# EAGLE design phase and amplifier ssb (EAGLE 9.1.2)
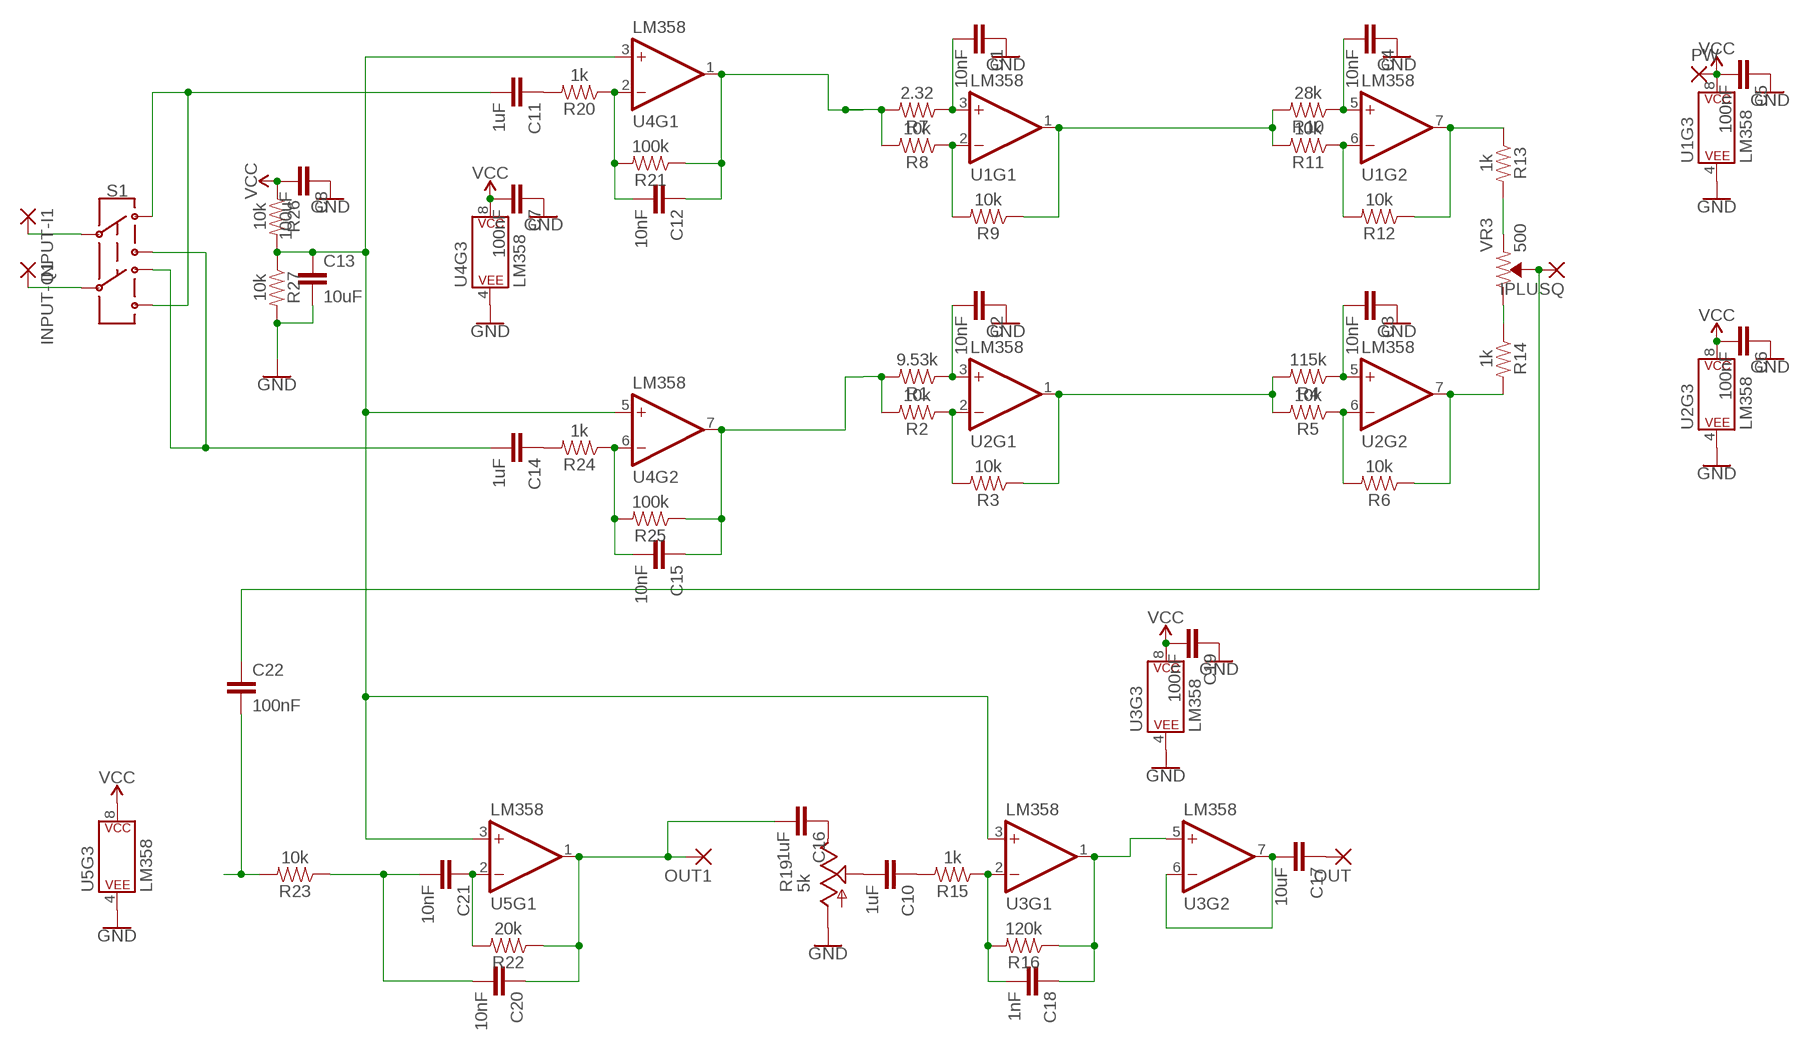
[diagram p0: schematic, sheet 1]

## Parts
C1  10nF  C5/3.5  [C5B3.5]
C2  10nF  C5/3.5  [C5B3.5]
C3  10nF  C5/3.5  [C5B3.5]
C4  10nF  C5/3.5  [C5B3.5]
C5  100nF  C5/3.5  [C5B3.5]
C6  100nF  C5/3.5  [C5B3.5]
C7  100nF  C5/3.5  [C5B3.5]
C8  100uF  C5/3.5  [C5B3.5]
C10  1uF  C5/3.5  [C5B3.5]
C11  1uF  C5/3.5  [C5B3.5]
C12  10nF  C5/3.5  [C5B3.5]
C13  10uF  C5/3.5  [C5B3.5]
C14  1uF  C5/3.5  [C5B3.5]
C15  10nF  C5/3.5  [C5B3.5]
C16  1uF  C5/3.5  [C5B3.5]
C17  10uF  C5/3.5  [C5B3.5]
C18  1nF  C5/3.5  [C5B3.5]
C19  100nF  C5/3.5  [C5B3.5]
C20  10nF  C5/3.5  [C5B3.5]
C21  10nF  C5/3.5  [C5B3.5]
C22  100nF  C5/3.5  [C5B3.5]
INPUT-I1  2,54/1,1  [2,54/1,1]
INPUT-Q1  2,54/1,1  [2,54/1,1]
IPLUSQ  2,54/1,1  [2,54/1,1]
OUT  2,54/1,1  [2,54/1,1]
OUT1  2,54/1,1  [2,54/1,1]
PW  2,54/1,1  [2,54/1,1]
R1  9.53k  1KOHM-HORIZ-1/4W-1%  [AXIAL-0.3]
R2  10k  1KOHM-HORIZ-1/4W-1%  [AXIAL-0.3]
R3  10k  1KOHM-HORIZ-1/4W-1%  [AXIAL-0.3]
R4  115k  1KOHM-HORIZ-1/4W-1%  [AXIAL-0.3]
R5  10k  1KOHM-HORIZ-1/4W-1%  [AXIAL-0.3]
R6  10k  1KOHM-HORIZ-1/4W-1%  [AXIAL-0.3]
R7  2.32  1KOHM-HORIZ-1/4W-1%  [AXIAL-0.3]
R8  10k  1KOHM-HORIZ-1/4W-1%  [AXIAL-0.3]
R9  10k  1KOHM-HORIZ-1/4W-1%  [AXIAL-0.3]
R10  28k  1KOHM-HORIZ-1/4W-1%  [AXIAL-0.3]
R11  10k  1KOHM-HORIZ-1/4W-1%  [AXIAL-0.3]
R12  10k  1KOHM-HORIZ-1/4W-1%  [AXIAL-0.3]
R13  1k  1KOHM-HORIZ-1/4W-1%  [AXIAL-0.3]
R14  1k  1KOHM-HORIZ-1/4W-1%  [AXIAL-0.3]
R15  1k  1KOHM-HORIZ-1/4W-1%  [AXIAL-0.3]
R16  120k  1KOHM-HORIZ-1/4W-1%  [AXIAL-0.3]
R19  5k  TRIM_US-B25V  [B25V]
R20  1k  1KOHM-HORIZ-1/4W-1%  [AXIAL-0.3]
R21  100k  1KOHM-HORIZ-1/4W-1%  [AXIAL-0.3]
R22  20k  1KOHM-HORIZ-1/4W-1%  [AXIAL-0.3]
R23  10k  1KOHM-HORIZ-1/4W-1%  [AXIAL-0.3]
R24  1k  1KOHM-HORIZ-1/4W-1%  [AXIAL-0.3]
R25  100k  1KOHM-HORIZ-1/4W-1%  [AXIAL-0.3]
R26  10k  1KOHM-HORIZ-1/4W-1%  [AXIAL-0.3]
R27  10k  1KOHM-HORIZ-1/4W-1%  [AXIAL-0.3]
S1  SWITCH-DPDT-PTH-GPI-152-3013  [SWITCH_DPDT_PTH_GPI-152-3013]
U1  LM358  [DIP08]
U2  LM358  [DIP08]
U3  LM358  [DIP08]
U4  LM358  [DIP08]
U5  LM358  [DIP08]
VR3  500  TRIMPOT-PTH-10MM-KNOB-1/2W-10%  [TRIMPOT-PTH-3386U]

## Nets
GND: C1.1 C2.1 C3.1 C4.1 C5.1 C6.1 C7.1 C8.1 C13.2 C19.1 R19.A R27.P$2 U1.4(P$V-) U2.4(P$V-) U3.4(P$V-) U4.4(P$V-) U5.4(P$V-)
N$1: C2.2 R1.P$1 U2.3(+IN)
N$2: R2.P$1 R3.P$2 U2.2(-IN)
N$3: R3.P$1 R4.P$2 R5.P$2 U2.1(OUT)
N$4: C13.1 R26.P$2 R27.P$1 U3.3(+IN) U4.3(+IN) U4.5(+IN) U5.3(+IN)
N$5: C3.2 R4.P$1 U2.5(+IN)
N$6: R5.P$1 R6.P$2 U2.6(-IN)
N$7: R8.P$1 R9.P$2 U1.2(-IN)
N$8: R6.P$1 R14.P$2 U2.7(OUT)
N$9: C1.2 R7.P$1 U1.3(+IN)
N$10: C12.1 R7.P$2 R8.P$2 R21.P$1 U4.1(OUT)
N$11: C4.2 R10.P$1 U1.5(+IN)
N$12: R9.P$1 R10.P$2 R11.P$2 U1.1(OUT)
N$13: R11.P$1 R12.P$2 U1.6(-IN)
N$14: R13.P$2 VR3.1(CCW)
N$15: R12.P$1 R13.P$1 U1.7(OUT)
N$16: R14.P$1 VR3.3(CW)
N$17: C22.1 IPLUSQ.1(P) VR3.2(WIPER)
N$18: C15.1 R1.P$2 R2.P$2 R25.P$1 U4.7(OUT)
N$19: C11.2 S1.10 S1.21
N$20: C18.1 R16.P$1 U3.1(OUT) U3.5(+IN)
N$21: C18.2 R15.P$1 R16.P$2 U3.2(-IN)
N$22: INPUT-I1.1(P) S1.C@1
N$23: C10.1 R15.P$2
N$24: C10.2 R19.S
N$25: C16.1 R19.E
N$26: C17.2 U3.6(-IN) U3.7(OUT)
N$27: C12.2 R20.P$1 R21.P$2 U4.2(-IN)
N$28: C14.2 S1.11 S1.20
N$29: C11.1 R20.P$2
N$30: C17.1 OUT.1(P)
N$31: C15.2 R24.P$1 R25.P$2 U4.6(-IN)
N$32: C22.2 R23.P$2
N$33: C14.1 R24.P$2
N$34: C16.2 C20.1 OUT1.1(P) R22.P$1 U5.1(OUT)
N$35: C21.1 R22.P$2 U5.2(-IN)
N$36: C20.2 C21.2 R23.P$1
N$37: INPUT-Q1.1(P) S1.C@2
VCC: C5.2 C6.2 C7.2 C8.2 C19.2 PW.1(P) R26.P$1 U1.8(P$V+) U2.8(P$V+) U3.8(P$V+) U4.8(P$V+) U5.8(P$V+)
Unconnected: U5.5(+IN) U5.6(-IN) U5.7(OUT)

## Library data of the parts
C1-C8 C10-C22 = capacitor-wima:C: CAPACITOR naming: grid - package width
INPUT-I1 INPUT-Q1 IPLUSQ OUT OUT1 PW = wirepad:2,54/1,1: THROUGH-HOLE PAD
R1-R12 R16 R21-R23 R25-R27 = SparkFun-Resistors:1KOHM: 1kΩ resistor A resistor is a passive two-terminal electrical component that implements electrical resistance as a circuit element. Resistors act to reduce current flow, and, at the same time, act to lower voltage levels within circuits. - Wikipedia; PROD_ID: RES-12182; VALUE: 1k
R13-R15 R20 R24 = SparkFun-Resistors:1KOHM: 1kΩ resistor A resistor is a passive two-terminal electrical component that implements electrical resistance as a circuit element. Resistors act to reduce current flow, and, at the same time, act to lower voltage levels within circuits. - Wikipedia; PROD_ID: RES-12182
R19 = pot:TRIM_US-: POTENTIOMETER
S1 = SparkFun-Switches:SWITCH-DPDT: Double-Pole, Double-Throw (DPDT) Switch Double-pole, double-throw switches. Variant Overview PTH-GPI-152-3013 Used on SparkFun Geiger Counter <https://www.sparkfun.com/products/11345> SMD-AY0202 Surface Mount DPDT Switch <https://www.sparkfun.com/products/597> (COM-00597) Used on e.g. LilyPad Arduino USB - ATmega32U4 Board <https://www.sparkfun.com/products/12049>; PROD_ID: SWCH-10554
U1-U5 = SparkFun-IC-Amplifiers:LM358: LM358 Jellybean op-amp Datasheet <http://www.sparkfun.com/datasheets/Components/General/LM358.pdf> SparkFun Products Op-Amp (Thru-Hole) - LM358 <https://www.sparkfun.com/products/9456> (COM-09456); PROD_ID: IC-09172
VR3 = SparkFun-Resistors:TRIMPOT: Trimming Potentiometer (Trimpot) Three-terminal potentiometers, with an adjustable wiper and two adjustable resistors. A pot can be used to create a configurable voltage divider, or as a variable resistor. "Trimpots" are a subset of potentiometers, usually intended for "set-and-forget" applications. They're often more delicate than standard potentiometers - rated for fewer turns. Variants PTH-KNOB - PTH Trimpot w/ finger-adjustable knob Trimpot 10K with Knob <https://www.sparkfun.com/products/9806> (COM-09806) Datasheet <http://www.sparkfun.com/datasheets/Components/General/TSR-3386.pdf> SMD-3MM-CLOSED-FRAME - SMD 3mm Square Closed-Frame Trimpot Used on e.g. EasyDriver - Stepper Motor Driver <https://www.sparkfun.com/products/12779> Datasheet <http://www.bitechnologies.com/pdfs/22.pdf> (22AR10KTR) SMD-5MM - SMD 5mm Square Closed-Frame Trimpot Used on e.g. IOIO-OTG - V2.2 <https://www.sparkfun.com/products/13613> Datasheet <http://www.vishay.com/docs/51008/ts53.pdf> (TS53YL502MR10) SMD-3MM-1/10W-25% - 3mm Square Open-Frame Trimpot Used on e.g. SparkFun Shapeoko <https://www.sparkfun.com/products/13899> Datasheet <http://www.bourns.com/docs/Product-Datasheets/TC33.pdf> (TC33X-2-103E); PROD_ID: RES-09730; SF_SKU: COM-09806; VALUE: 10k

## Net classes
0 default: width 0.762 mm, drill 0.762 mm, clearance 0.508 mm

## Board
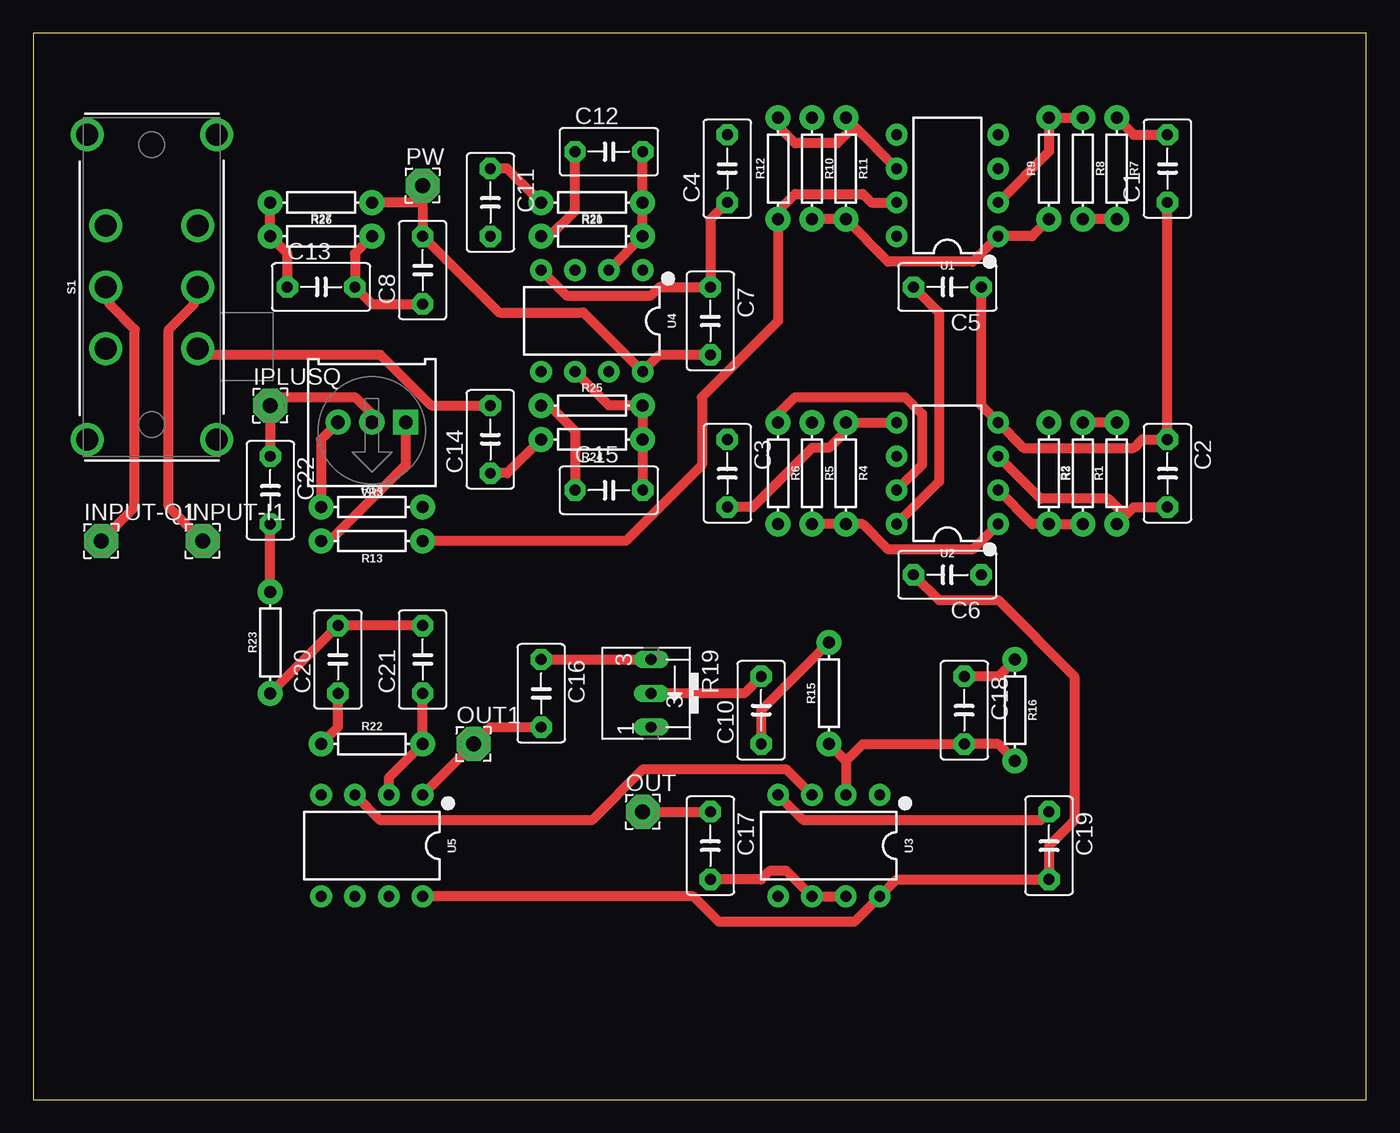
[diagram p1: board, top side]
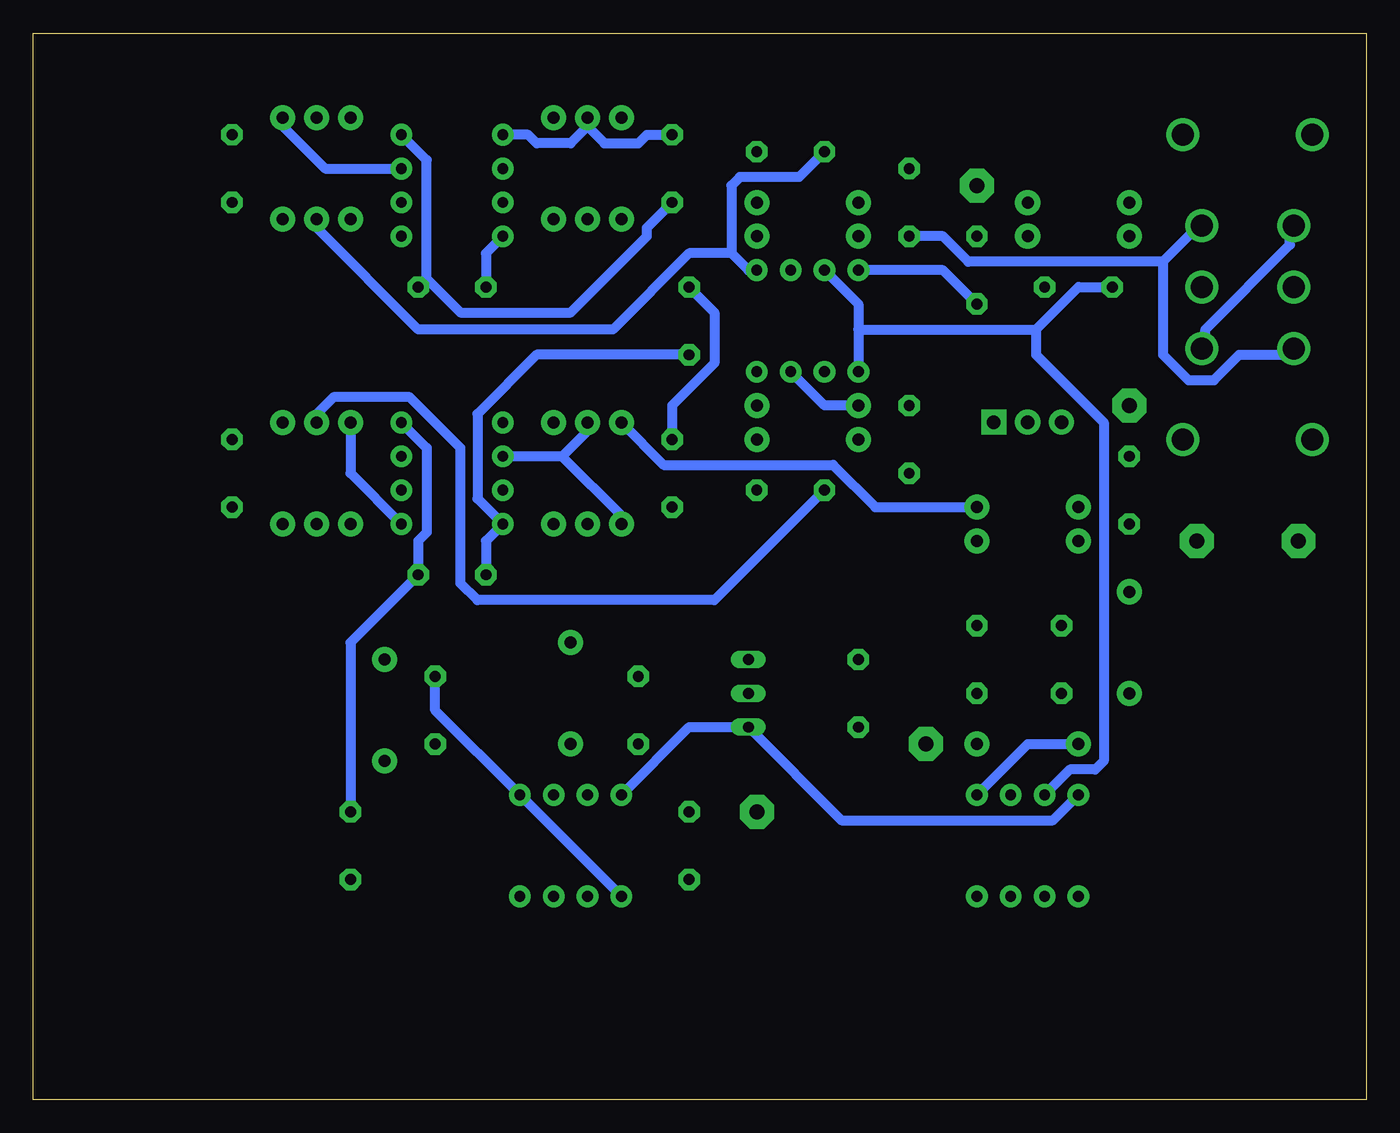
[diagram p2: board, bottom side, seen from below]

Size 100 x 80 mm. Coordinates in mm from the lower left corner, seen from the top.
Outline: 0,0 100,0 100,80 0,80 0,0
Copper layers (1*16): Top 0.035mm / dielectric 1.5mm / Bottom 0.035mm
Design rules "default": minimum track width 6mil, minimum drill 0.35mm, track to track 6mil, track to pad 6mil, pad to pad 6mil, via to via 6mil, smd to smd 6mil, copper to edge 40mil, drill to drill 6mil, minimum pad ring 10mil, minimum via ring 8mil, stop-mask expansion 4mil, vias tented up to drill 0mil, thermal gap 10mil

### Footprints (pad centres in the part's own frame; a part is rotated, then mirrored left to right if it is on the bottom)
C5B3.5 = drill 0.813 pad 1.6 octagon: 1 -2.54,0; 2 2.54,0
2,54/1,1 = drill 1.118 pad 2.54 octagon: 1 0,0
AXIAL-0.3 = drill 0.9 pad 1.88: P$1 -3.81,0; P$2 3.81,0
B25V = drill 0.813 long: A 2.54,0.635; E -2.54,0.635; S 0,0.635
SWITCH_DPDT_PTH_GPI-152-3013 = drill 1.65: 10 -4.6,3.455; 11 -4.6,-3.455; 20 4.6,3.455; 21 4.6,-3.455; C@1 0,3.455; C@2 0,-3.455; P$7 11.43,4.85; P$8 -11.43,4.85; P$9 -11.43,-4.85; P$10 11.43,-4.85
DIP08 = drill 0.813 pad 1.626: 1 -3.81,-3.81; 2 -1.27,-3.81; 3 1.27,-3.81; 4 3.81,-3.81; 5 3.81,3.81; 6 1.27,3.81; 7 -1.27,3.81; 8 -3.81,3.81
TRIMPOT-PTH-3386U = drill 1.016 pad 1.88 square: 1 -2.54,-0.015 | drill 1.016 pad 1.88: 2 0,-0.015; 3 2.54,-0.015

### Placement (x,y rotation side)
C1  85.09,69.85 90 top
C2  85.09,46.99 270 top
C3  52.07,46.99 270 top
C4  52.07,69.85 90 top
C5  68.58,60.96 180 top
C6  68.58,39.37 180 top
C7  50.8,58.42 270 top
C8  29.21,62.23 90 top
C10  54.61,29.21 90 top
C11  34.29,67.31 270 top
C12  43.18,71.12 0 top
C13  21.59,60.96 0 top
C14  34.29,49.53 90 top
C15  43.18,45.72 0 top
C16  38.1,30.48 270 top
C17  50.8,19.05 270 top
C18  69.85,29.21 270 top
C19  76.2,19.05 270 top
C20  22.86,33.02 90 top
C21  29.21,33.02 90 top
C22  17.78,45.72 270 top
INPUT-I1  12.7,41.91 0 top
INPUT-Q1  5.08,41.91 0 top
IPLUSQ  17.78,52.07 0 top
OUT  45.72,21.59 0 top
OUT1  33.02,26.67 0 top
PW  29.21,68.58 0 top
R1  81.28,46.99 90 top
R2  78.74,46.99 90 top
R3  76.2,46.99 270 top
R4  60.96,46.99 270 top
R5  58.42,46.99 270 top
R6  55.88,46.99 270 top
R7  81.28,69.85 270 top
R8  78.74,69.85 270 top
R9  76.2,69.85 90 top
R10  58.42,69.85 270 top
R11  60.96,69.85 270 top
R12  55.88,69.85 90 top
R13  25.4,41.91 180 top
R14  25.4,44.45 0 top
R15  59.69,30.48 90 top
R16  73.66,29.21 270 top
R19  45.72,30.48 270 top
R20  41.91,67.31 180 top
R21  41.91,64.77 0 top
R22  25.4,26.67 0 top
R23  17.78,34.29 90 top
R24  41.91,49.53 180 top
R25  41.91,52.07 0 top
R26  21.59,67.31 180 top
R27  21.59,64.77 0 top
S1  8.89,60.96 270 top
U1  68.58,68.58 90 top
U2  68.58,46.99 90 top
U3  59.69,19.05 180 top
U4  41.91,58.42 180 top
U5  25.4,19.05 180 top
VR3  25.4,50.8 180 top

### Tracks (layer width: path | path; a pad name or v marks a point on that pad's centre or on a via)
GND
  Top 0.762: C4.1 50.8,66.04 C7.1 46.99,60.96 46.35,60.33 40.01,60.33 U4.4 | R27.P$2 24.13,63.5 C13.2 25.4,59.69 C8.1 | C5.1 71.12,52.07 U2.4 74.3,48.9 82.55,48.9 83.19,49.53 C2.1 C1.1 | U3.4 57.78,20.95 75.56,20.95 C19.1
  Bottom 0.762: C3.1 52.07,52.07 48.9,55.24 48.9,59.05 C7.1 | U4.4 31.75,62.23 C8.1 | U3.4 50.8,27.94 R19.A 39.37,20.95 23.5,20.95 U5.4 | U2.4 70.48,48.9 70.48,42.55 71.12,41.91 C6.1 76.2,34.29 C19.1 | U1.4 70.48,70.48 70.48,61.59 | C5.1 70.48,61.59 | C4.1 53.98,65.41 53.98,64.77 59.69,59.05 67.94,59.05 70.48,61.59
N$1
  Top 0.762: C2.2 82.55,44.45 81.92,43.81 | U2.3 75.56,45.09 80.64,45.09 81.92,43.81 | 81.92,43.81 R1.P$1
N$2
  Top 0.762: U2.2 74.93,43.18 R3.P$2 R2.P$1
N$3
  Top 0.762: R5.P$2 R4.P$2 62.23,43.18 64.14,41.27 70.48,41.27 U2.1
  Bottom 0.762: U2.1 76.2,46.99 R3.P$1
N$4
  Top 0.762: U5.3 26.04,20.95 41.91,20.95 45.72,24.77 56.52,24.77 U3.3 | C13.1 19.05,63.5 R27.P$1 R26.P$2
  Bottom 0.762: 38.1,57.78 38.1,59.69 U4.3 | 38.1,57.78 U4.5 | C13.1 21.59,60.96 24.77,57.78 | 38.1,57.78 24.77,57.78 | U5.3 22.23,24.77 20.32,24.77 19.68,25.4 19.68,50.8 24.77,55.88 24.77,57.78
N$5
  Top 0.762: C3.2 53.98,44.45 58.42,48.9 59.69,48.9 60.96,50.16 R4.P$1 U2.5
N$6
  Bottom 0.762: 60.33,48.26 U2.6 | 60.33,48.26 58.42,50.16 R5.P$1 | R6.P$2 55.88,43.81 60.33,48.26
N$7
  Top 0.762: U1.2 76.2,71.12 R9.P$2 R8.P$1
N$8
  Top 0.762: U2.7 66.67,47.62 66.67,51.44 65.41,52.7 57.15,52.7 55.88,51.44 R6.P$1
  Bottom 0.762: R14.P$2 36.83,44.45 40.01,47.62 52.7,47.62 R6.P$1
N$9
  Top 0.762: C1.2 82.55,72.39 R7.P$1
  Bottom 0.762: U1.3 78.11,69.85 81.28,73.03 R7.P$1
N$10
  Top 0.762: R7.P$2 R8.P$2 | C12.1 40.64,66.67 38.73,64.77 R21.P$1
  Bottom 0.762: U4.1 46.35,62.23 47.62,63.5 | 47.62,63.5 47.62,68.58 46.99,69.22 42.55,69.22 C12.1 | R8.P$2 78.74,65.41 71.12,57.78 56.52,57.78 50.8,63.5 47.62,63.5
N$11
  Bottom 0.762: C4.2 53.98,72.39 54.61,71.75 57.15,71.75 58.42,73.03 | U1.5 62.87,72.39 62.23,71.75 59.69,71.75 58.42,73.03 | 58.42,73.03 R10.P$1
N$12
  Top 0.762: R10.P$2 R11.P$2 64.14,62.87 70.48,62.87 U1.1 74.93,64.77 R9.P$1
N$13
  Top 0.762: 61.59,73.03 U1.6 | R12.P$2 55.88,73.03 57.15,71.75 60.33,71.75 61.59,73.03 | 61.59,73.03 R11.P$1
N$14
  Top 0.762: R13.P$2 22.23,41.91 27.94,47.62 VR3.1
N$15
  Top 0.762: U1.7 62.87,67.31 62.23,67.94 57.15,67.94 55.88,66.67 R12.P$1 55.88,58.42 50.16,52.7 50.16,47.62 44.45,41.91 R13.P$1
N$16
  Top 0.762: R14.P$1 21.59,49.53 VR3.3
N$17
  Top 0.762: C22.1 IPLUSQ.1 18.41,52.7 24.13,52.7 25.4,51.44 VR3.2
N$18
  Top 0.762: R1.P$2 R2.P$2 | C15.1 40.64,50.16 38.73,52.07 R25.P$1
  Bottom 0.762: U4.7 40.64,52.07 R25.P$1 | R2.P$2 78.74,51.44 77.47,52.7 71.75,52.7 67.94,48.9 67.94,38.73 66.67,37.47 48.9,37.47 C15.1
N$19
  Bottom 0.762: C11.2 31.75,64.77 29.84,62.87 15.24,62.87 | 15.24,62.87 12.7,65.41 S1.10 | 15.24,62.87 15.24,55.88 13.34,53.98 11.43,53.98 9.53,55.88 5.71,55.88 S1.21
N$20
  Top 0.762: C18.1 72.39,31.75 R16.P$1
  Bottom 0.762: U3.5 U3.1 69.85,29.21 C18.1
N$21
  Top 0.762: R16.P$2 72.39,26.67 C18.2 62.23,26.67 60.96,25.4 | 60.96,25.4 U3.2 | R15.P$1 60.96,25.4
N$22
  Top 0.762: INPUT-I1.1 10.16,44.45 10.16,57.78 12.06,59.69 12.06,60.96 S1.C@1
N$23
  Top 0.762: C10.1 54.61,29.21 R15.P$2
N$24
  Top 0.762: R19.S 53.34,30.48 C10.2
N$25
  Top 0.762: C16.1 R19.E
N$26
  Top 0.762: C17.2 54.61,16.51 55.24,17.14 56.52,17.14 U3.6 U3.7
N$27
  Top 0.762: C12.2 R20.P$1 R21.P$2 U4.2
N$28
  Top 0.762: C14.2 29.84,52.07 26.04,55.88 12.7,55.88 S1.20
  Bottom 0.762: S1.11 5.71,65.41 5.71,64.14 12.06,57.78 12.06,56.52 S1.20
N$29
  Top 0.762: C11.1 35.56,69.85 R20.P$2
N$30
  Top 0.762: OUT.1 C17.1
N$31
  Top 0.762: C15.2 R24.P$1 R25.P$2 43.18,52.07 U4.6
N$32
  Top 0.762: R23.P$2 C22.2
N$33
  Top 0.762: C14.1 35.56,46.99 R24.P$2
N$34
  Top 0.762: C20.1 22.86,27.94 R22.P$1 | C16.2 34.29,27.94 OUT1.1 U5.1
  Bottom 0.762: R22.P$1 25.4,26.67 U5.1
N$35
  Top 0.762: C21.1 R22.P$2 26.67,24.13 U5.2
N$36
  Top 0.762: C21.2 C20.2 R23.P$1
N$37
  Top 0.762: INPUT-Q1.1 7.62,44.45 7.62,57.78 5.71,59.69 5.71,60.96 S1.C@2
VCC
  Top 0.762: U5.8 49.53,15.24 51.44,13.34 61.59,13.34 U3.8 64.77,16.51 C19.2 76.2,19.05 78.11,20.95 78.11,31.75 72.39,37.47 67.94,37.47 C6.2 | U2.8 67.94,46.35 67.94,59.05 C5.2 | C7.2 46.99,55.88 U4.8 41.27,59.05 34.92,59.05 C8.2 29.21,67.31 | PW.1 29.21,67.31 | 29.21,67.31 R26.P$1
  Bottom 0.762: C6.2 66.04,41.91 U2.8 66.67,45.09 66.67,51.44 62.23,55.88 C7.2 | C5.2 66.04,63.5 U1.8